# Altium schematic sheet analog_ref_offset.SchDoc
size A4
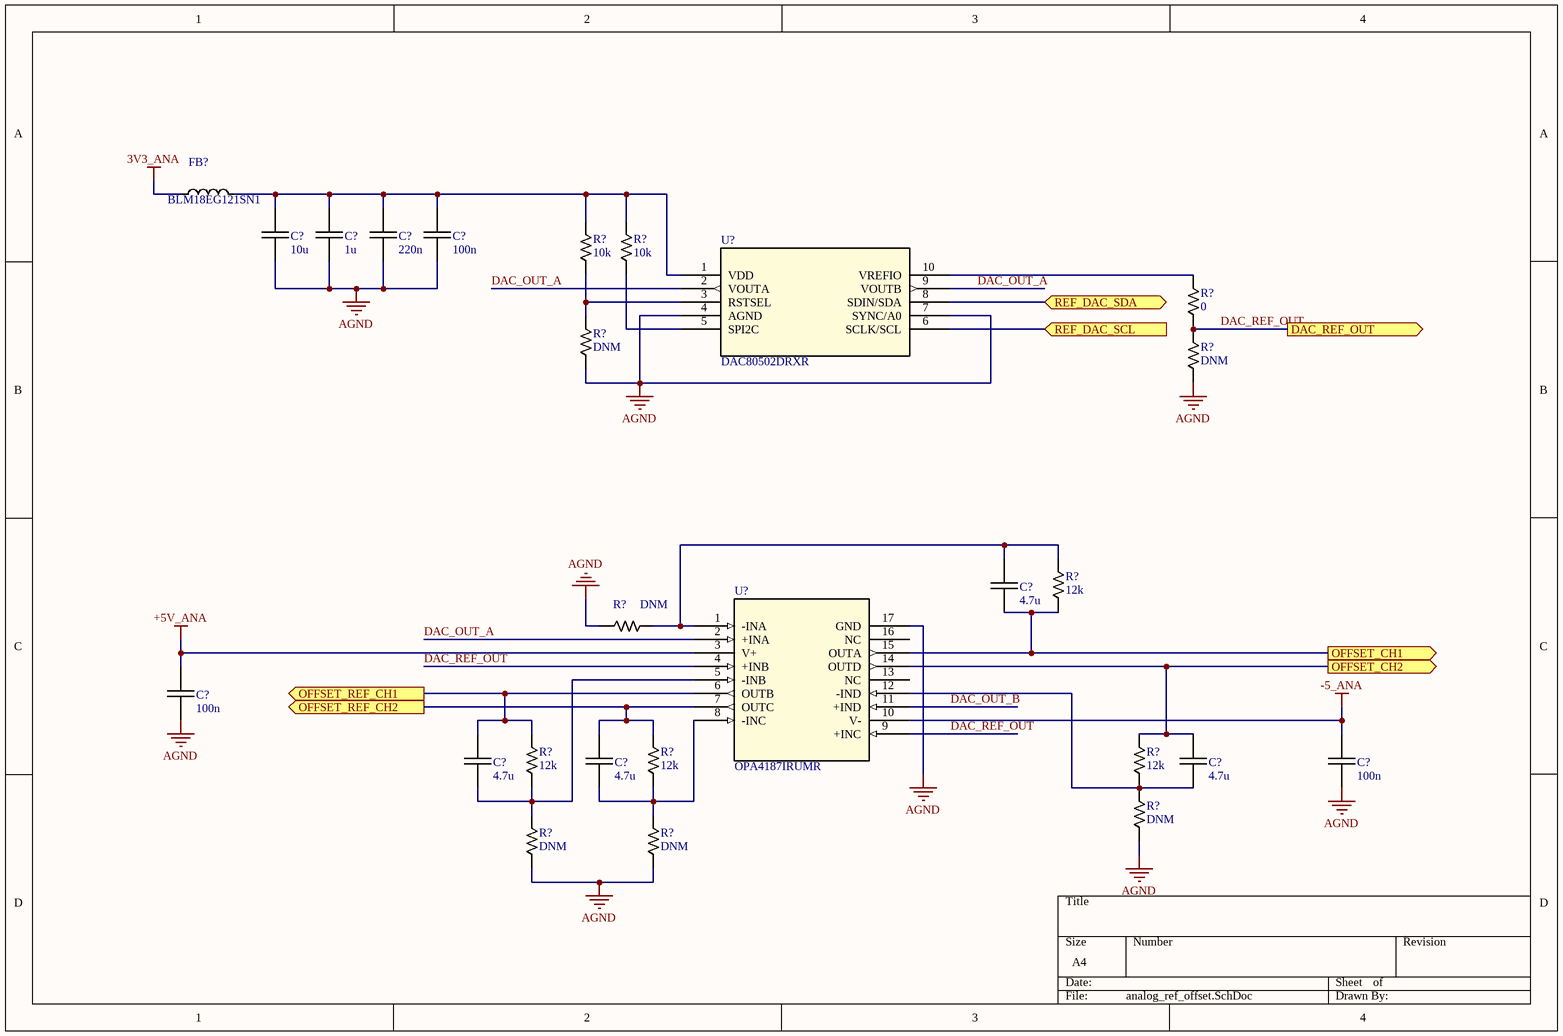
[diagram p0: analog_ref_offset.SchDoc]

## Parts
(Parts that share a designator on the sheet are numbered #1, #2 ... from top to bottom, then left to right.)
C?#1  value 10u  [CAPC1608X09N]  (hidden comment: MLLC Capacitor)
C?#2  value 1u  [CAPC1005X06N]  (hidden comment: MLLC Capacitor)
C?#3  value 220n  [CAPC1005X06N]  (hidden comment: MLLC Capacitor)
C?#4  value 100n  [CAPC1005X06N]  (hidden comment: MLLC Capacitor)
C?#5  value 4.7u  [CAPC1005X06N]  (hidden comment: MLLC Capacitor)
C?#6  value 100n  [CAPC1005X06N]  (hidden comment: MLLC Capacitor)
C?#7  value 4.7u  [CAPC1005X06N]  (hidden comment: MLLC Capacitor)
C?#8  value 4.7u  [CAPC1005X06N]  (hidden comment: MLLC Capacitor)
C?#9  value 4.7u  [CAPC1005X06N]  (hidden comment: MLLC Capacitor)
C?#10  value 100n  [CAPC1005X06N]  (hidden comment: MLLC Capacitor)
FB?  value BLM18EG121SN1  [INDC1608X08N]  (hidden comment: Chip Inductor)
R?#1  value 10k  [RESC1005X04N]  (hidden comment: Chip Resistor)
R?#2  value 10k  [RESC1005X04N]  (hidden comment: Chip Resistor)
R?#3  value 0  [RESC1005X04N]  (hidden comment: Chip Resistor)
R?#4  value DNM  [RESC1005X04N]  (hidden comment: Chip Resistor)
R?#5  value DNM  [RESC1005X04N]  (hidden comment: Chip Resistor)
R?#6  value 12k  [RESC1005X04N]  (hidden comment: Chip Resistor)
R?#7  value DNM  [RESC1005X04N]  (hidden comment: Chip Resistor)
R?#8  value 12k  [RESC1005X04N]  (hidden comment: Chip Resistor)
R?#9  value 12k  [RESC1005X04N]  (hidden comment: Chip Resistor)
R?#10  value 12k  [RESC1005X04N]  (hidden comment: Chip Resistor)
R?#11  value DNM  [RESC1005X04N]  (hidden comment: Chip Resistor)
R?#12  value DNM  [RESC1005X04N]  (hidden comment: Chip Resistor)
R?#13  value DNM  [RESC1005X04N]  (hidden comment: Chip Resistor)
U?#1  DAC80502DRXR  [SON_02DRXR_TEX]
U?#2  OPA4187IRUMR  [RUM16_TEX]

## Ports
DAC_REF_OUT (out), OFFSET_CH1 (out), OFFSET_CH2 (out), OFFSET_REF_CH1 (out), OFFSET_REF_CH2 (out), REF_DAC_SCL (in), REF_DAC_SDA (bidir)

## Nets
3V3_ANA: FB?.1
+5V_ANA: C?#6.2 U?#2.3(V+)
-5_ANA: C?#10.2 U?#2.10(V-)
AGND: C?#1.1 C?#2.1 C?#3.1 C?#4.1 C?#6.1 C?#10.1 R?#4.1 R?#5.1 R?#7.1 R?#11.1 R?#12.1 R?#13.1 U?#1.4(AGND) U?#1.7(SYNC/A0) U?#2.17(GND)
DAC_OUT_A: U?#1.2(VOUTA) U?#1.9(VOUTB) U?#2.2(+INA)
DAC_OUT_B: U?#2.11(+IND)
DAC_REF_OUT: R?#3.1 R?#5.2 U?#2.4(+INB) U?#2.9(+INC) ; port DAC_REF_OUT
OFFSET_CH1: C?#5.2 R?#6.1 U?#2.15(OUTA) ; port OFFSET_CH1
OFFSET_CH2: C?#9.1 R?#10.2 U?#2.14(OUTD) ; port OFFSET_CH2
OFFSET_REF_CH1: C?#7.1 R?#8.2 U?#2.6(OUTB) ; port OFFSET_REF_CH1
OFFSET_REF_CH2: C?#8.1 R?#9.2 U?#2.7(OUTC) ; port OFFSET_REF_CH2
REF_DAC_SCL: U?#1.6(SCLK/SCL) ; port REF_DAC_SCL
REF_DAC_SDA: U?#1.8(SDIN/SDA) ; port REF_DAC_SDA
NetC?#1_2: C?#1.2 C?#2.2 C?#3.2 C?#4.2 FB?.2 R?#1.2 R?#2.2 U?#1.1(VDD)
NetC?#5_1: C?#5.1 R?#6.2 R?#7.2 U?#2.1(-INA)
NetC?#7_2: C?#7.2 R?#8.1 R?#12.2 U?#2.5(-INB)
NetC?#8_2: C?#8.2 R?#9.1 R?#13.2 U?#2.8(-INC)
NetC?#9_2: C?#9.2 R?#10.1 R?#11.2 U?#2.12(-IND)
NetR?#1_1: R?#1.1 R?#4.2 U?#1.3(RSTSEL)
NetR?#2_1: R?#2.1 U?#1.5(SPI2C)
NetR?#3_2: R?#3.2 U?#1.10(VREFIO)

Not connected (* = marked no-connect by the designer): U?#2 13(NC) 16(NC)

## Library data of the parts
C?#1-C?#10 = Cap: Rating: *
FB? = Ind
R?#1-R?#13 = Res
U?#1 = DAC80502: Dual-channel, 1-LSB INL, 16-bit, SPI voltage-output digital-to-analog converter (DAC); Built_By: EMA_Matt; Vendor: Texas Instruments; SourceLibrary: TI_2020-07-16; Datasheet: https://www.ti.com/lit/ds/symlink/dac80502.pdf?ts=1594755472964&ref_url=https%253A%252F%252Fwww.ti.com%252Fstore%252Fti%252Fen%252Fp%252Fproduct%252F%253Fp%253DDAC80502DRXR; Copyright: Copyright (C) 2018 Accelerated Designs. All rights reserved; Manufacturer_Part_Number: DAC80502DRXR; RefDes: RefDes; Type: DEV; ComponentLink1Description: Product Page; ComponentLink1URL: https://www.ti.com/product/DAC80502
U?#2 = OPA4187: Zero-drift (10µV, 0.001µV/C˚), MUX-friendly, low-noise, RRO, CMOS quad precision op amp (quad); Vendor: Texas Instruments; Built_By: EMA_Cory; SourceLibrary: Add_to_database_2020-10-30; Datasheet: https://www.ti.com/lit/ds/symlink/opa4187.pdf?ts=1604082514403&ref_url=https%253A%252F%252Fwww.ti.com%252Fstore%252Fti%252Fen%252Fp%252Fproduct%252F%253Fp%253DOPA4187IRUMR; Manufacturer_Part_Number: OPA4187IRUMR; Copyright: Copyright (C) 2018 Accelerated Designs. All rights reserved; RefDes: RefDes; Type: DEV; ComponentLink1Description: Product Page; ComponentLink1URL: https://www.ti.com/product/OPA4187